# Altium schematic sheet clock_pow.SchDoc
size 594 x 420 mm; SheetNumber: 4; SheetTotal: 4
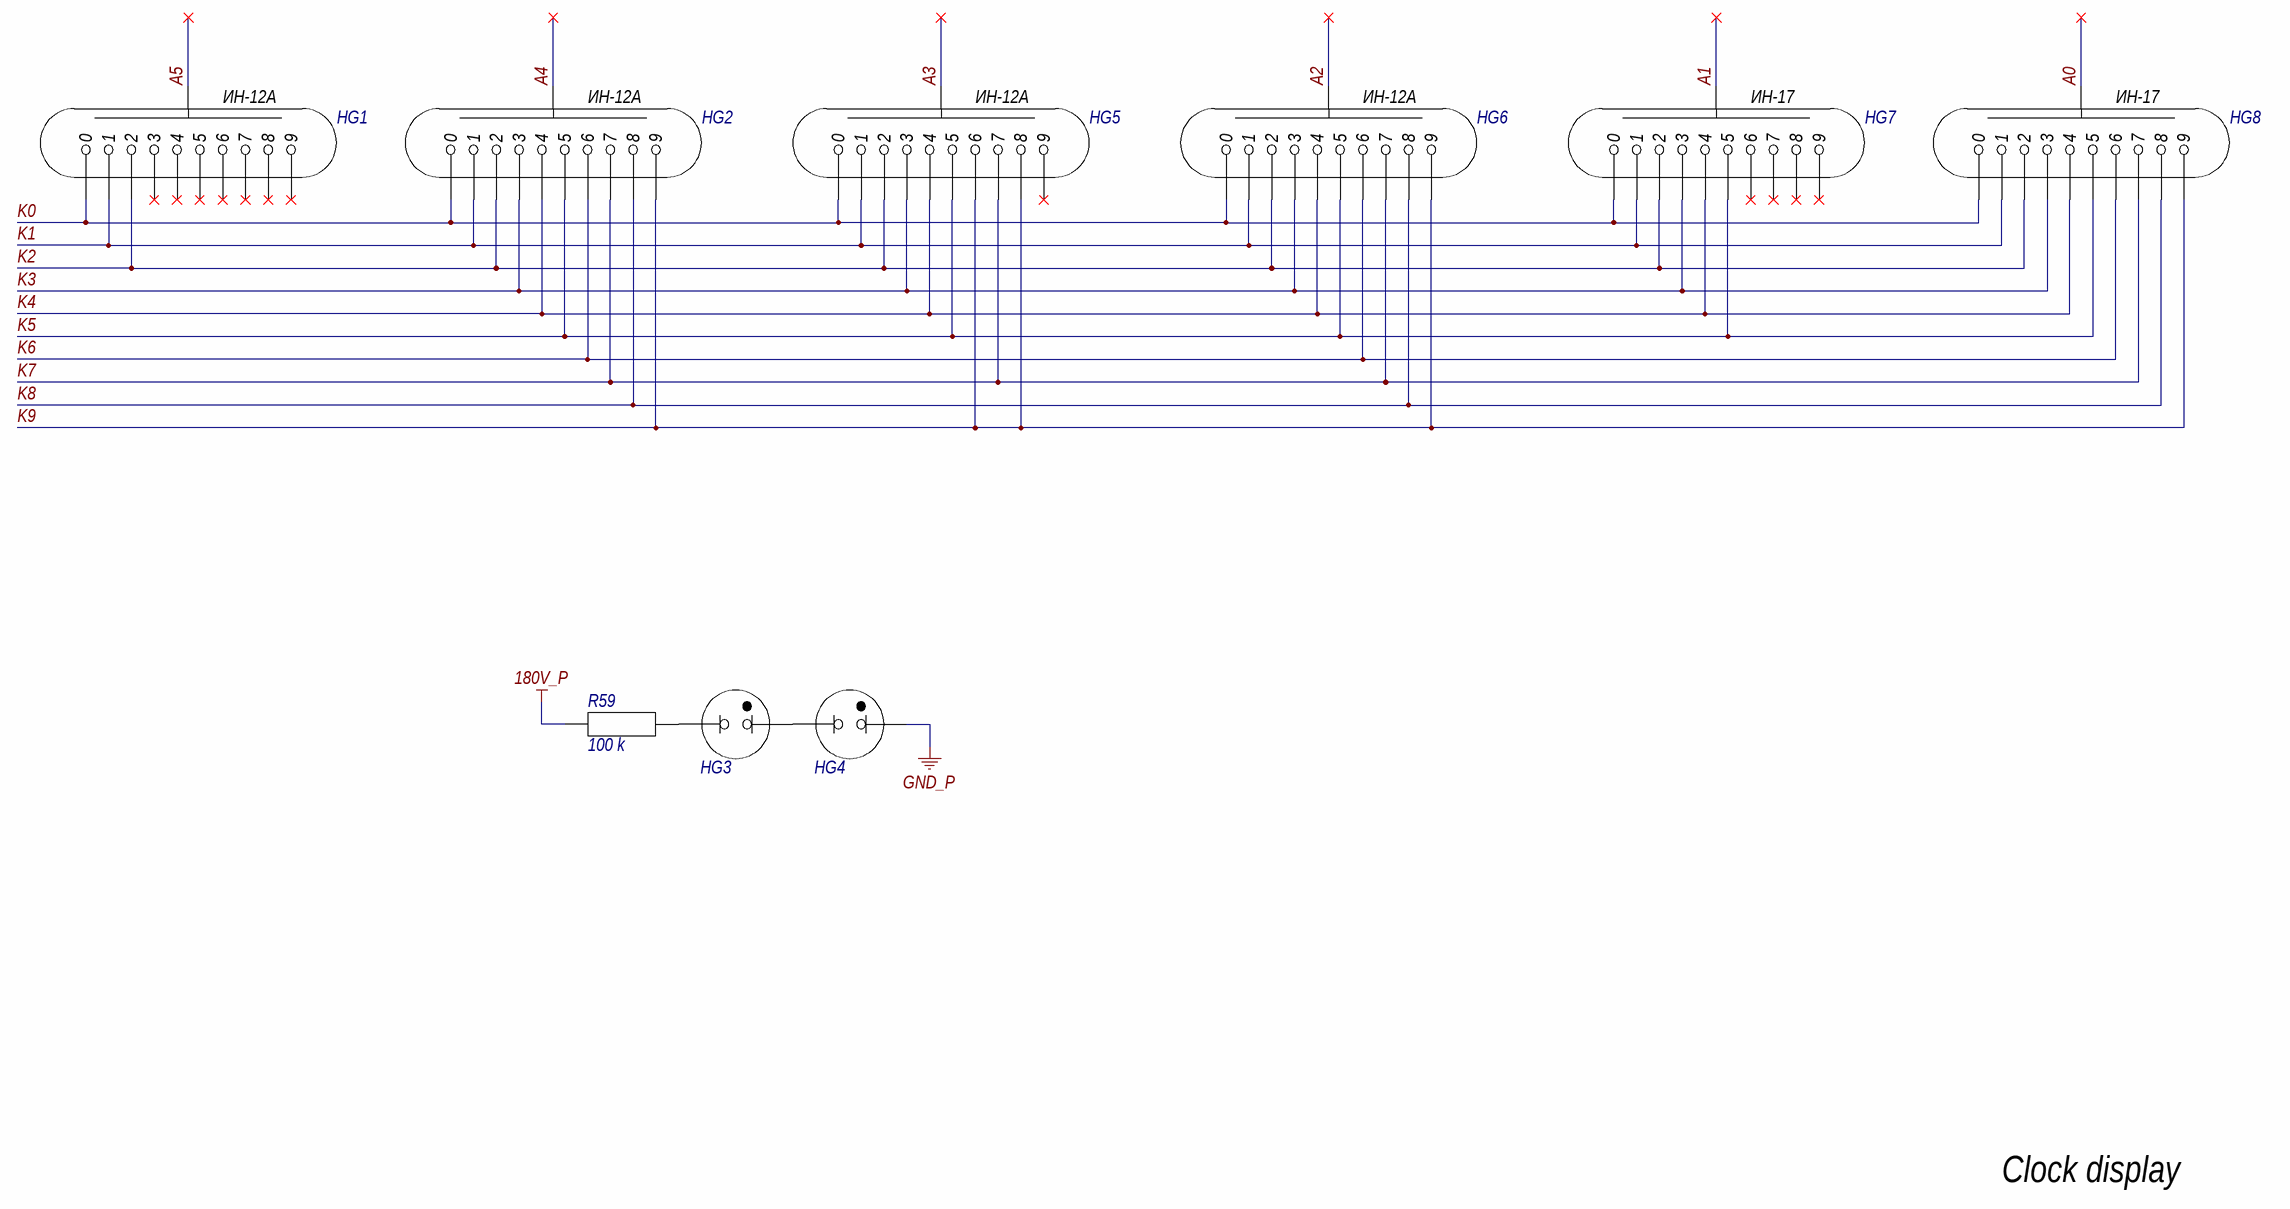
[diagram p0: clock_pow.SchDoc]

## Parts
HG1  ИН-12  [IN-12-NO-SOKET]  (value not drawn)
HG2  ИН-12  [IN-12-NO-SOKET]  (value not drawn)
HG3  ИНА_ТН_02  [INA_TN_02]  (value not drawn)
HG4  ИНА_ТН_02  [INA_TN_02]  (value not drawn)
HG5  ИН-12  [IN-12-NO-SOKET]  (value not drawn)
HG6  ИН-12  [IN-12-NO-SOKET]  (value not drawn)
HG7  ИН-17  [IN-17]  (value not drawn)
HG8  ИН-17  [IN-17]  (value not drawn)
R59  value 100 k  [RES-DIP]  (hidden comment: R)

## Nets
180V_P: R59.1
GND_P: HG4.2(K)
A0: HG8.1
A1: HG7.1
A2: HG6.1
A3: HG5.1
A4: HG2.1
A5: HG1.1
K0: HG1.2(0) HG2.2(0) HG5.2(0) HG6.2(0) HG7.2(0) HG8.2(0)
K1: HG1.11(1) HG2.11(1) HG5.11(1) HG6.11(1) HG7.3(1) HG8.3(1)
K2: HG1.10(2) HG2.10(2) HG5.10(2) HG6.10(2) HG7.4(2) HG8.4(2)
K3: HG2.9(3) HG5.9(3) HG6.9(3) HG7.5(3) HG8.5(3)
K4: HG2.8(4) HG5.8(4) HG6.8(4) HG7.6(4) HG8.6(4)
K5: HG2.7(5) HG5.7(5) HG6.7(5) HG7.7(5) HG8.7(5)
K6: HG2.6 HG6.6 HG8.8(6)
K7: HG2.5(7) HG5.5(7) HG6.5(7) HG8.9(7)
K8: HG2.4(8) HG6.4(8) HG8.10(8)
K9: HG2.3(9) HG5.4(8) HG5.6 HG6.3(9) HG8.11(9)
NetHG3_1: HG3.1(A) R59.2
NetHG3_2: HG3.2(K) HG4.1(A)

Not connected (* = marked no-connect by the designer): HG1 3(9)* 4(8)* 5(7)* 6* 7(5)* 8(4)* 9(3)*; HG5 3(9)*; HG7 8(6)* 9(7)* 10(8)* 11(9)*

## Notes on the sheet
- Clock display
- Перв. застосув.
- Справ. №
- Підп. дата
- Інв. № дубл.
- Взам. інв. №
- Підп. та дата
- Зм.
- Розроб.
- Арк.
- № докум.
- Підп.
- Дата
- Літ.
- Маса
- Маштаб
- Перев.
- Аркушів
- Інв. № подл.
- Н.контр.
- Затв.
- КПІ ім. Ігоря Сікорського
- ALTIUM GOSTBOM2.0 KEV
- Копіював
- Формат А2
- (in symbol ИН-12) ИН-12А